# Altium schematic sheet Lighting.SchDoc
size A4
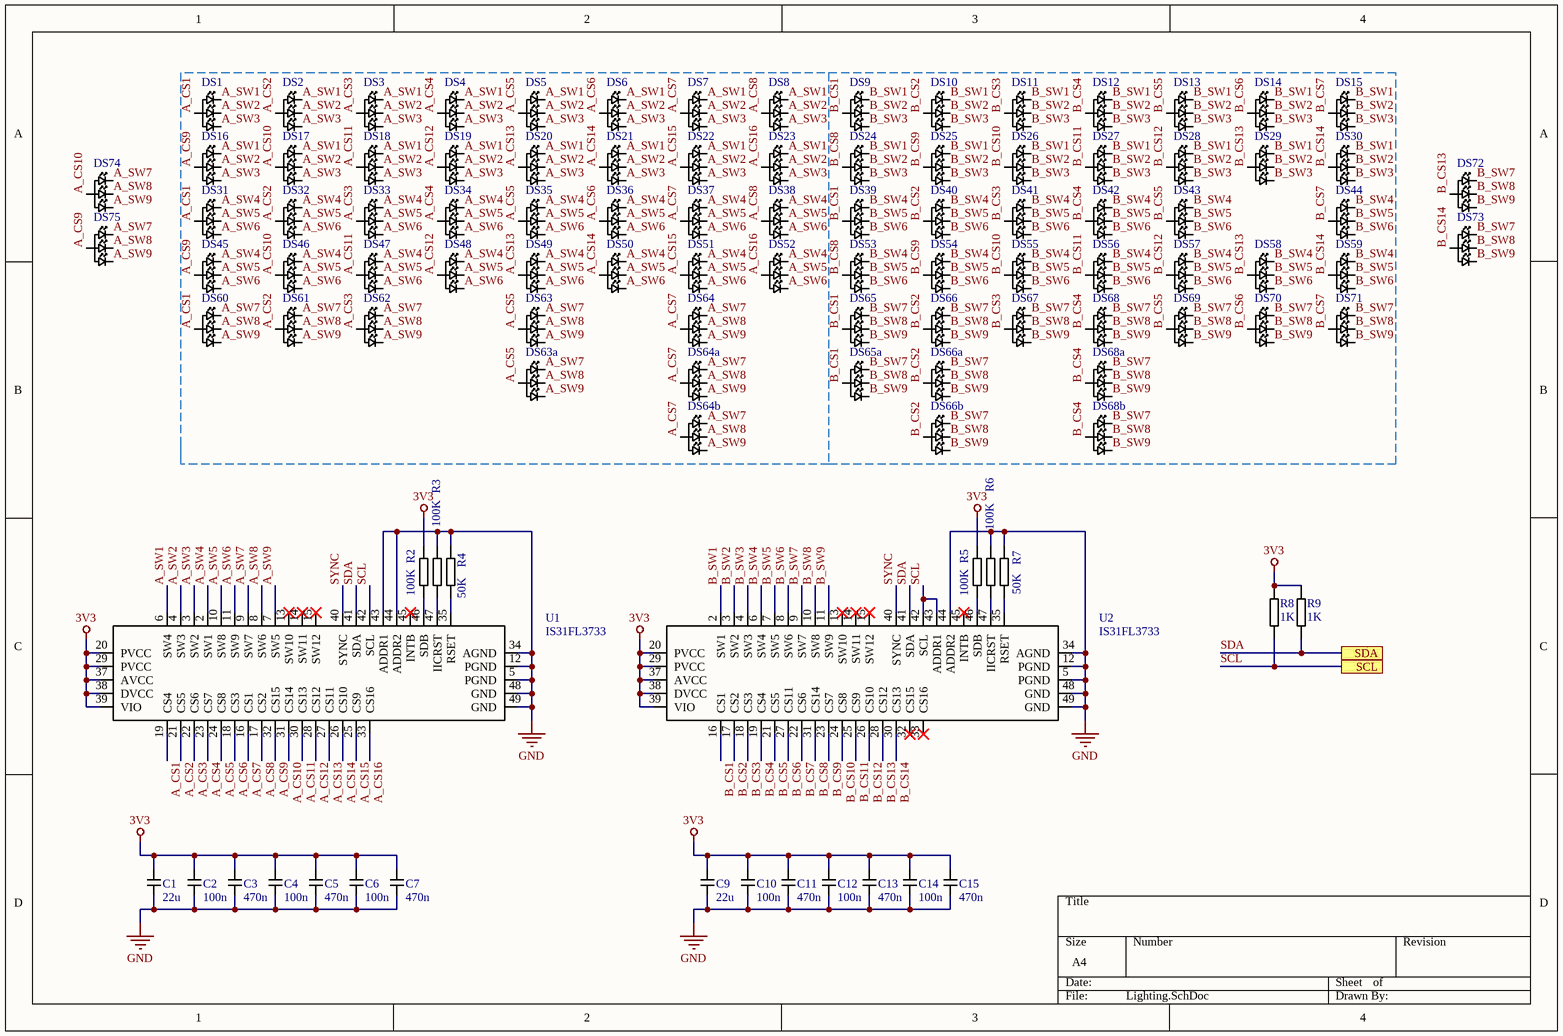
[diagram p0: Lighting.SchDoc]

## Parts
C1  22u  [Capacitor_0603]
C2  100n  [Capacitor_0603]
C3  470n  [Capacitor_0603]
C4  100n  [Capacitor_0603]
C5  470n  [Capacitor_0603]
C6  100n  [Capacitor_0603]
C7  470n  [Capacitor_0603]
C9  22u  [Capacitor_0603]
C10  100n  [Capacitor_0603]
C11  470n  [Capacitor_0603]
C12  100n  [Capacitor_0603]
C13  470n  [Capacitor_0603]
C14  100n  [Capacitor_0603]
C15  470n  [Capacitor_0603]
DS1  RGB_CA  [LED_1616_4P]  (value not drawn)
DS2  RGB_CA  [LED_1616_4P]  (value not drawn)
DS3  RGB_CA  [LED_1616_4P]  (value not drawn)
DS4  RGB_CA  [LED_1616_4P]  (value not drawn)
DS5  RGB_CA  [LED_1616_4P]  (value not drawn)
DS6  RGB_CA  [LED_1616_4P]  (value not drawn)
DS7  RGB_CA  [LED_1616_4P]  (value not drawn)
DS8  RGB_CA  [LED_1616_4P]  (value not drawn)
DS9  RGB_CA  [LED_1616_4P]  (value not drawn)
DS10  RGB_CA  [LED_1616_4P]  (value not drawn)
DS11  RGB_CA  [LED_1616_4P]  (value not drawn)
DS12  RGB_CA  [LED_1616_4P]  (value not drawn)
DS13  RGB_CA  [LED_1616_4P]  (value not drawn)
DS14  RGB_CA  [LED_1616_4P]  (value not drawn)
DS15  RGB_CA  [LED_1616_4P]  (value not drawn)
DS16  RGB_CA  [LED_1616_4P]  (value not drawn)
DS17  RGB_CA  [LED_1616_4P]  (value not drawn)
DS18  RGB_CA  [LED_1616_4P]  (value not drawn)
DS19  RGB_CA  [LED_1616_4P]  (value not drawn)
DS20  RGB_CA  [LED_1616_4P]  (value not drawn)
DS21  RGB_CA  [LED_1616_4P]  (value not drawn)
DS22  RGB_CA  [LED_1616_4P]  (value not drawn)
DS23  RGB_CA  [LED_1616_4P]  (value not drawn)
DS24  RGB_CA  [LED_1616_4P]  (value not drawn)
DS25  RGB_CA  [LED_1616_4P]  (value not drawn)
DS26  RGB_CA  [LED_1616_4P]  (value not drawn)
DS27  RGB_CA  [LED_1616_4P]  (value not drawn)
DS28  RGB_CA  [LED_1616_4P]  (value not drawn)
DS29  RGB_CA  [LED_1616_4P]  (value not drawn)
DS30  RGB_CA  [LED_1616_4P]  (value not drawn)
DS31  RGB_CA  [LED_1616_4P]  (value not drawn)
DS32  RGB_CA  [LED_1616_4P]  (value not drawn)
DS33  RGB_CA  [LED_1616_4P]  (value not drawn)
DS34  RGB_CA  [LED_1616_4P]  (value not drawn)
DS35  RGB_CA  [LED_1616_4P]  (value not drawn)
DS36  RGB_CA  [LED_1616_4P]  (value not drawn)
DS37  RGB_CA  [LED_1616_4P]  (value not drawn)
DS38  RGB_CA  [LED_1616_4P]  (value not drawn)
DS39  RGB_CA  [LED_1616_4P]  (value not drawn)
DS40  RGB_CA  [LED_1616_4P]  (value not drawn)
DS41  RGB_CA  [LED_1616_4P]  (value not drawn)
DS42  RGB_CA  [LED_1616_4P]  (value not drawn)
DS43  RGB_CA  [LED_1616_4P]  (value not drawn)
DS44  RGB_CA  [LED_1616_4P]  (value not drawn)
DS45  RGB_CA  [LED_1616_4P]  (value not drawn)
DS46  RGB_CA  [LED_1616_4P]  (value not drawn)
DS47  RGB_CA  [LED_1616_4P]  (value not drawn)
DS48  RGB_CA  [LED_1616_4P]  (value not drawn)
DS49  RGB_CA  [LED_1616_4P]  (value not drawn)
DS50  RGB_CA  [LED_1616_4P]  (value not drawn)
DS51  RGB_CA  [LED_1616_4P]  (value not drawn)
DS52  RGB_CA  [LED_1616_4P]  (value not drawn)
DS53  RGB_CA  [LED_1616_4P]  (value not drawn)
DS54  RGB_CA  [LED_1616_4P]  (value not drawn)
DS55  RGB_CA  [LED_1616_4P]  (value not drawn)
DS56  RGB_CA  [LED_1616_4P]  (value not drawn)
DS57  RGB_CA  [LED_1616_4P]  (value not drawn)
DS58  RGB_CA  [LED_1616_4P]  (value not drawn)
DS59  RGB_CA  [LED_1616_4P]  (value not drawn)
DS60  RGB_CA  [LED_1616_4P]  (value not drawn)
DS61  RGB_CA  [LED_1616_4P]  (value not drawn)
DS62  RGB_CA  [LED_1616_4P]  (value not drawn)
DS63  RGB_CA  [LED_1616_4P]  (value not drawn)
DS63a  RGB_CA  [LED_1616_4P]  (value not drawn)
DS64  RGB_CA  [LED_1616_4P]  (value not drawn)
DS64a  RGB_CA  [LED_1616_4P]  (value not drawn)
DS64b  RGB_CA  [LED_1616_4P]  (value not drawn)
DS65  RGB_CA  [LED_1616_4P]  (value not drawn)
DS65a  RGB_CA  [LED_1616_4P]  (value not drawn)
DS66  RGB_CA  [LED_1616_4P]  (value not drawn)
DS66a  RGB_CA  [LED_1616_4P]  (value not drawn)
DS66b  RGB_CA  [LED_1616_4P]  (value not drawn)
DS67  RGB_CA  [LED_1616_4P]  (value not drawn)
DS68  RGB_CA  [LED_1616_4P]  (value not drawn)
DS68a  RGB_CA  [LED_1616_4P]  (value not drawn)
DS68b  RGB_CA  [LED_1616_4P]  (value not drawn)
DS69  RGB_CA  [LED_1616_4P]  (value not drawn)
DS70  RGB_CA  [LED_1616_4P]  (value not drawn)
DS71  RGB_CA  [LED_1616_4P]  (value not drawn)
DS72  RGB_CA  [LED_1616_4P]  (value not drawn)
DS73  RGB_CA  [LED_1616_4P]  (value not drawn)
DS74  RGB_CA  [LED_1616_4P]  (value not drawn)
DS75  RGB_CA  [LED_1616_4P]  (value not drawn)
R2  100K  [Resistor_0603]
R3  100K  [Resistor_0603]
R4  50K  [Resistor_0603]
R5  100K  [Resistor_0603]
R6  100K  [Resistor_0603]
R7  50K  [Resistor_0603]
R8  1K  [Resistor_0603]
R9  1K  [Resistor_0603]
U1  IS31FL3733  [QFP_48_7mm_TP]
U2  IS31FL3733  [QFP_48_7mm_TP]

## Ports
SCL, SDA

## Nets
3V3: C1.2 C2.2 C3.2 C4.2 C5.2 C6.2 C7.2 C9.2 C10.2 C11.2 C12.2 C13.2 C14.2 C15.2 R2.2 R5.2 R8.2 R9.2 U1.20(PVCC) U1.29(PVCC) U1.37(AVCC) U1.38(DVCC) U1.39(VIO) U2.20(PVCC) U2.29(PVCC) U2.37(AVCC) U2.38(DVCC) U2.39(VIO)
GND: C1.1 C2.1 C3.1 C4.1 C5.1 C6.1 C7.1 C9.1 C10.1 C11.1 C12.1 C13.1 C14.1 C15.1 R3.2 R4.2 R6.2 R7.2 U1.5(PGND) U1.12(PGND) U1.34(AGND) U1.43(ADDR1) U1.44(ADDR2) U1.48(GND) U1.49(GND) U2.5(PGND) U2.12(PGND) U2.34(AGND) U2.44(ADDR2) U2.48(GND) U2.49(GND)
A_CS1: DS1.3 DS31.3 DS60.3 U1.19(CS4)
A_CS2: DS2.3 DS32.3 DS61.3 U1.21(CS5)
A_CS3: DS3.3 DS33.3 DS62.3 U1.22(CS6)
A_CS4: DS4.3 DS34.3 U1.23(CS7)
A_CS5: DS5.3 DS35.3 DS63.3 DS63a.3 U1.24(CS8)
A_CS6: DS6.3 DS36.3 U1.18(CS3)
A_CS7: DS7.3 DS37.3 DS64.3 DS64a.3 DS64b.3 U1.16(CS1)
A_CS8: DS8.3 DS38.3 U1.17(CS2)
A_CS9: DS16.3 DS45.3 DS75.3 U1.32(CS15)
A_CS10: DS17.3 DS46.3 DS74.3 U1.31(CS14)
A_CS11: DS18.3 DS47.3 U1.30(CS13)
A_CS12: DS19.3 DS48.3 U1.28(CS12)
A_CS13: DS20.3 DS49.3 U1.27(CS11)
A_CS14: DS21.3 DS50.3 U1.26(CS10)
A_CS15: DS22.3 DS51.3 U1.25(CS9)
A_CS16: DS23.3 DS52.3 U1.33(CS16)
A_SW1: DS1.1 DS2.1 DS3.1 DS4.1 DS5.1 DS6.1 DS7.1 DS8.1 DS16.1 DS17.1 DS18.1 DS19.1 DS20.1 DS21.1 DS22.1 DS23.1 U1.6(SW4)
A_SW2: DS1.2 DS2.2 DS3.2 DS4.2 DS5.2 DS6.2 DS7.2 DS8.2 DS16.2 DS17.2 DS18.2 DS19.2 DS20.2 DS21.2 DS22.2 DS23.2 U1.4(SW3)
A_SW3: DS1.4 DS2.4 DS3.4 DS4.4 DS5.4 DS6.4 DS7.4 DS8.4 DS16.4 DS17.4 DS18.4 DS19.4 DS20.4 DS21.4 DS22.4 DS23.4 U1.3(SW2)
A_SW4: DS31.1 DS32.1 DS33.1 DS34.1 DS35.1 DS36.1 DS37.1 DS38.1 DS45.1 DS46.1 DS47.1 DS48.1 DS49.1 DS50.1 DS51.1 DS52.1 U1.2(SW1)
A_SW5: DS31.2 DS32.2 DS33.2 DS34.2 DS35.2 DS36.2 DS37.2 DS38.2 DS45.2 DS46.2 DS47.2 DS48.2 DS49.2 DS50.2 DS51.2 DS52.2 U1.10(SW8)
A_SW6: DS31.4 DS32.4 DS33.4 DS34.4 DS35.4 DS36.4 DS37.4 DS38.4 DS45.4 DS46.4 DS47.4 DS48.4 DS49.4 DS50.4 DS51.4 DS52.4 U1.11(SW9)
A_SW7: DS60.1 DS61.1 DS62.1 DS63.1 DS63a.1 DS64.1 DS64a.1 DS64b.1 DS74.1 DS75.1 U1.9(SW7)
A_SW8: DS60.2 DS61.2 DS62.2 DS63.2 DS63a.2 DS64.2 DS64a.2 DS64b.2 DS74.2 DS75.2 U1.8(SW6)
A_SW9: DS60.4 DS61.4 DS62.4 DS63.4 DS63a.4 DS64.4 DS64a.4 DS64b.4 DS74.4 DS75.4 U1.7(SW5)
B_CS1: DS9.3 DS39.3 DS65.3 DS65a.3 U2.16(CS1)
B_CS2: DS10.3 DS40.3 DS66.3 DS66a.3 DS66b.3 U2.17(CS2)
B_CS3: DS11.3 DS41.3 DS67.3 U2.18(CS3)
B_CS4: DS12.3 DS42.3 DS68.3 DS68a.3 DS68b.3 U2.19(CS4)
B_CS5: DS13.3 DS43.3 DS69.3 U2.21(CS5)
B_CS6: DS14.3 DS70.3 U2.27(CS11)
B_CS7: DS15.3 DS44.3 DS71.3 U2.22(CS6)
B_CS8: DS24.3 DS53.3 U2.31(CS14)
B_CS9: DS25.3 DS54.3 U2.23(CS7)
B_CS10: DS26.3 DS55.3 U2.24(CS8)
B_CS11: DS27.3 DS56.3 U2.25(CS9)
B_CS12: DS28.3 DS57.3 U2.26(CS10)
B_CS13: DS29.3 DS58.3 DS72.3 U2.28(CS12)
B_CS14: DS30.3 DS59.3 DS73.3 U2.30(CS13)
B_SW1: DS9.1 DS10.1 DS11.1 DS12.1 DS13.1 DS14.1 DS15.1 DS24.1 DS25.1 DS26.1 DS27.1 DS28.1 DS29.1 DS30.1 U2.2(SW1)
B_SW2: DS9.2 DS10.2 DS11.2 DS12.2 DS13.2 DS14.2 DS15.2 DS24.2 DS25.2 DS26.2 DS27.2 DS28.2 DS29.2 DS30.2 U2.3(SW2)
B_SW3: DS9.4 DS10.4 DS11.4 DS12.4 DS13.4 DS14.4 DS15.4 DS24.4 DS25.4 DS26.4 DS27.4 DS28.4 DS29.4 DS30.4 U2.4(SW3)
B_SW4: DS39.1 DS40.1 DS41.1 DS42.1 DS43.1 DS44.1 DS53.1 DS54.1 DS55.1 DS56.1 DS57.1 DS58.1 DS59.1 U2.6(SW4)
B_SW5: DS39.2 DS40.2 DS41.2 DS42.2 DS43.2 DS44.2 DS53.2 DS54.2 DS55.2 DS56.2 DS57.2 DS58.2 DS59.2 U2.7(SW5)
B_SW6: DS39.4 DS40.4 DS41.4 DS42.4 DS43.4 DS44.4 DS53.4 DS54.4 DS55.4 DS56.4 DS57.4 DS58.4 DS59.4 U2.8(SW6)
B_SW7: DS65.1 DS65a.1 DS66.1 DS66a.1 DS66b.1 DS67.1 DS68.1 DS68a.1 DS68b.1 DS69.1 DS70.1 DS71.1 DS72.1 DS73.1 U2.9(SW7)
B_SW8: DS65.2 DS65a.2 DS66.2 DS66a.2 DS66b.2 DS67.2 DS68.2 DS68a.2 DS68b.2 DS69.2 DS70.2 DS71.2 DS72.2 DS73.2 U2.10(SW8)
B_SW9: DS65.4 DS65a.4 DS66.4 DS66a.4 DS66b.4 DS67.4 DS68.4 DS68a.4 DS68b.4 DS69.4 DS70.4 DS71.4 DS72.4 DS73.4 U2.11(SW9)
SCL: R8.1 U1.42(SCL) U2.42(SCL) U2.43(ADDR1) ; port SCL
SDA: R9.1 U1.41(SDA) U2.41(SDA) ; port SDA
SYNC: U1.40(SYNC) U2.40(SYNC)
NetR2_1: R2.1 U1.46(SDB)
NetR3_1: R3.1 U1.47(IICRST)
NetR4_1: R4.1 U1.35(RSET)
NetR5_1: R5.1 U2.46(SDB)
NetR6_1: R6.1 U2.47(IICRST)
NetR7_1: R7.1 U2.35(RSET)

Not connected (* = marked no-connect by the designer): U1 13(SW10)* 14(SW11)* 15(SW12)* 45(INTB)*; U2 13(SW10)* 14(SW11)* 15(SW12)* 32(CS15)* 33(CS16)* 45(INTB)*

## Library data of the parts
C1-C7 C9-C15 = Capacitor
R2-R9 = Resistor